# Altium schematic sheet S3C_MuxJTAG.SchDoc
size A4; Organization: UltraZohm; SheetNumber: 11; SheetTotal: 40
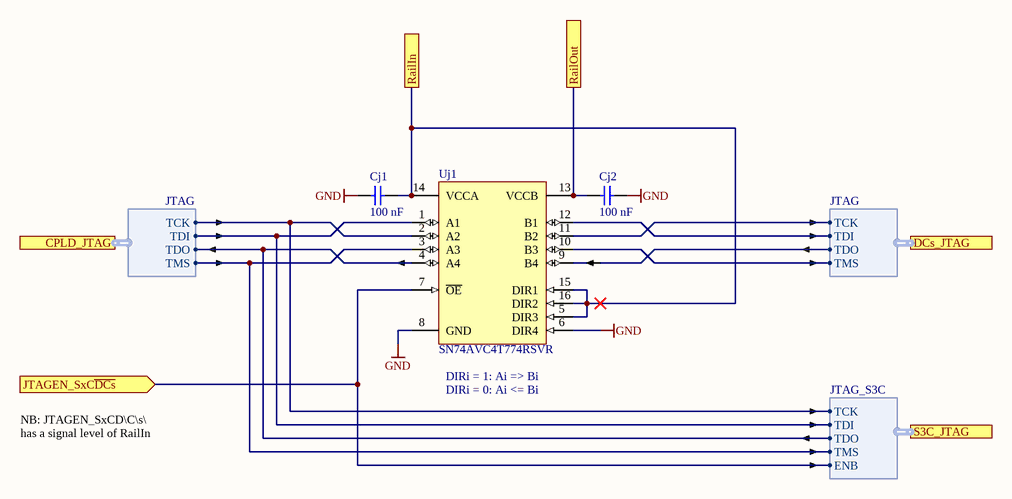
[diagram p0: S3C_MuxJTAG.SchDoc]

## Parts
Cj1  100 nF  [C_0603_TE]
Cj2  100 nF  [C_0603_TE]
Uj1  SN74AVC4T774RSVR  [QFN40P260X180X55-16N]

## Ports
CPLD_JTAG (harness JTAG), DCs_JTAG (harness JTAG), JTAGEN_SxC~{DCs} (in), RailIn, RailOut, S3C_JTAG (harness JTAG_S3C)

## Harnesses
JTAG: TCK, TDI, TDO, TMS
JTAG_S3C: TCK, TDI, TDO, TMS, ENB

## Nets
GND: Cj1.2 Cj2.1 Uj1.6(DIR4) Uj1.8(GND)
JTAGEN_SxC~{DCs}: Uj1.7(~{OE}) ; port JTAGEN_SxC~{DCs}, port S3C_JTAG.ENB
RailIn: Cj1.1 Uj1.5(DIR3) Uj1.14(VCCA) Uj1.15(DIR1) Uj1.16(DIR2) ; port RailIn
RailOut: Cj2.2 Uj1.13(VCCB) ; port RailOut
NetUj1_1: Uj1.1(A1) ; port S3C_JTAG.TDI, port CPLD_JTAG.TDI
NetUj1_2: Uj1.2(A2) ; port S3C_JTAG.TCK, port CPLD_JTAG.TCK
NetUj1_3: Uj1.3(A3) ; port S3C_JTAG.TMS, port CPLD_JTAG.TMS
NetUj1_4: Uj1.4(A4) ; port S3C_JTAG.TDO, port CPLD_JTAG.TDO
NetUj1_9: Uj1.9(B4) ; port DCs_JTAG.TDO
NetUj1_10: Uj1.10(B3) ; port DCs_JTAG.TMS
NetUj1_11: Uj1.11(B2) ; port DCs_JTAG.TCK
NetUj1_12: Uj1.12(B1) ; port DCs_JTAG.TDI

## Notes on the sheet
- (near Uj1) DIRi = 1: Ai => Bi
- DIRi = 0: Ai <= Bi
- NB: JTAGEN_SxCD\C\s\ has a signal level of RailIn
- Title
- Revision:
- Design Engineer:
- Date:
- Project:
- Sheet
- of

## Library data of the parts
Cj1 Cj2 = UZgen_C_0603_100nF_50V_X7R: Generic capacitor; Manufacturer: UZgen; Tolerance: 10 %; Voltage: 50 V; Created from: AGeiger; Value: 100 nF; Technology: X7R; Manufacturer Part Number: UZgen_C_0603_100nF_50V_X7R; PartID: 1; Created On: 02/07/2024 14:42:23; Device Package: 0603; Mounting Type: SMD; Last Updated: 02/08/2024 14:45:57
Uj1 = SN74AVC4T774RSVR: 4-Bit Dual-Supply Bus Transceiver with configurable Voltage-Level Shifting; belongs to SN74AVC4T774RSVR; Manufacturer: Texas Instruments; Created from: MGremer; Manufacturer Part Number: SN74AVC4T774RSVR; PartID: 1; Created On: 30/11/2020 12:34:01; ComponentLink1Description: Datasheet; ComponentLink1URL: https://www.ti.com/store/ti/en/p/product/?p=SN74AVC4T774RSVR; Component Type: Level Shifter; Device Package: UQFN; Last Updated: 03/09/2024 12:45:00; Mounting Type: SMD; Supplier 1: Mouser; Supplier Part Number 1: 595-SN74AVC4T774RSVR; Supplier 2: LCSC; Supplier Part Number 2: C779392; Type: Level Shifter; Live Cycle Status: 1; LCSC Part Number: C779392; Stock number: not stored